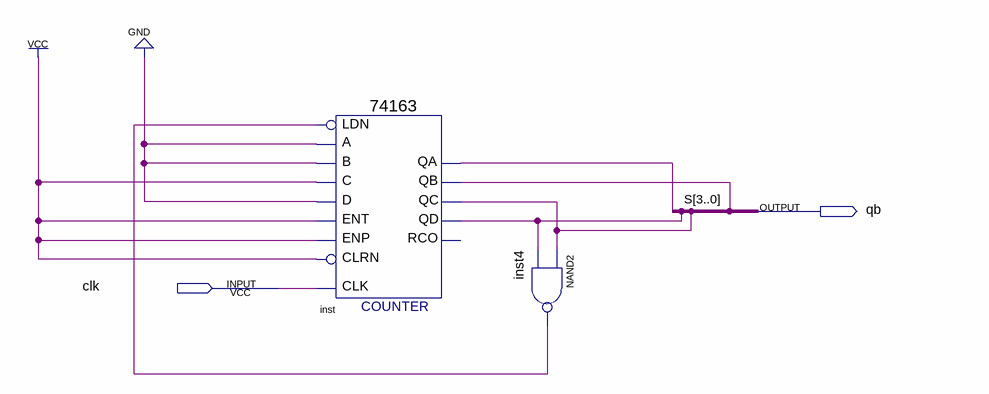
[diagram p0: schematic sheet]
// Quartus schematic SpecialCount4_12.bdf as structural Verilog: 2 symbols, 2 pins
module SpecialCount4_12 (
  input  clk,
  output qb
);

  wire inst4_out, inst_qa, inst_qb, inst_qc, inst_qd;

  \74163  inst (
    .C(1'b1), .B(1'b0), .A(1'b0), .ENT(1'b1), .D(1'b0), .CLRN(1'b1), .CLK(clk), .ENP(1'b1), .LDN(inst4_out),
    .QA(inst_qa), .QB(inst_qb), .QC(inst_qc), .QD(inst_qd));  // open: RCO
  nand inst4 (inst4_out, inst_qc, inst_qd);
endmodule
